# Altium schematic sheet power_amplifier.SchDoc
size A4
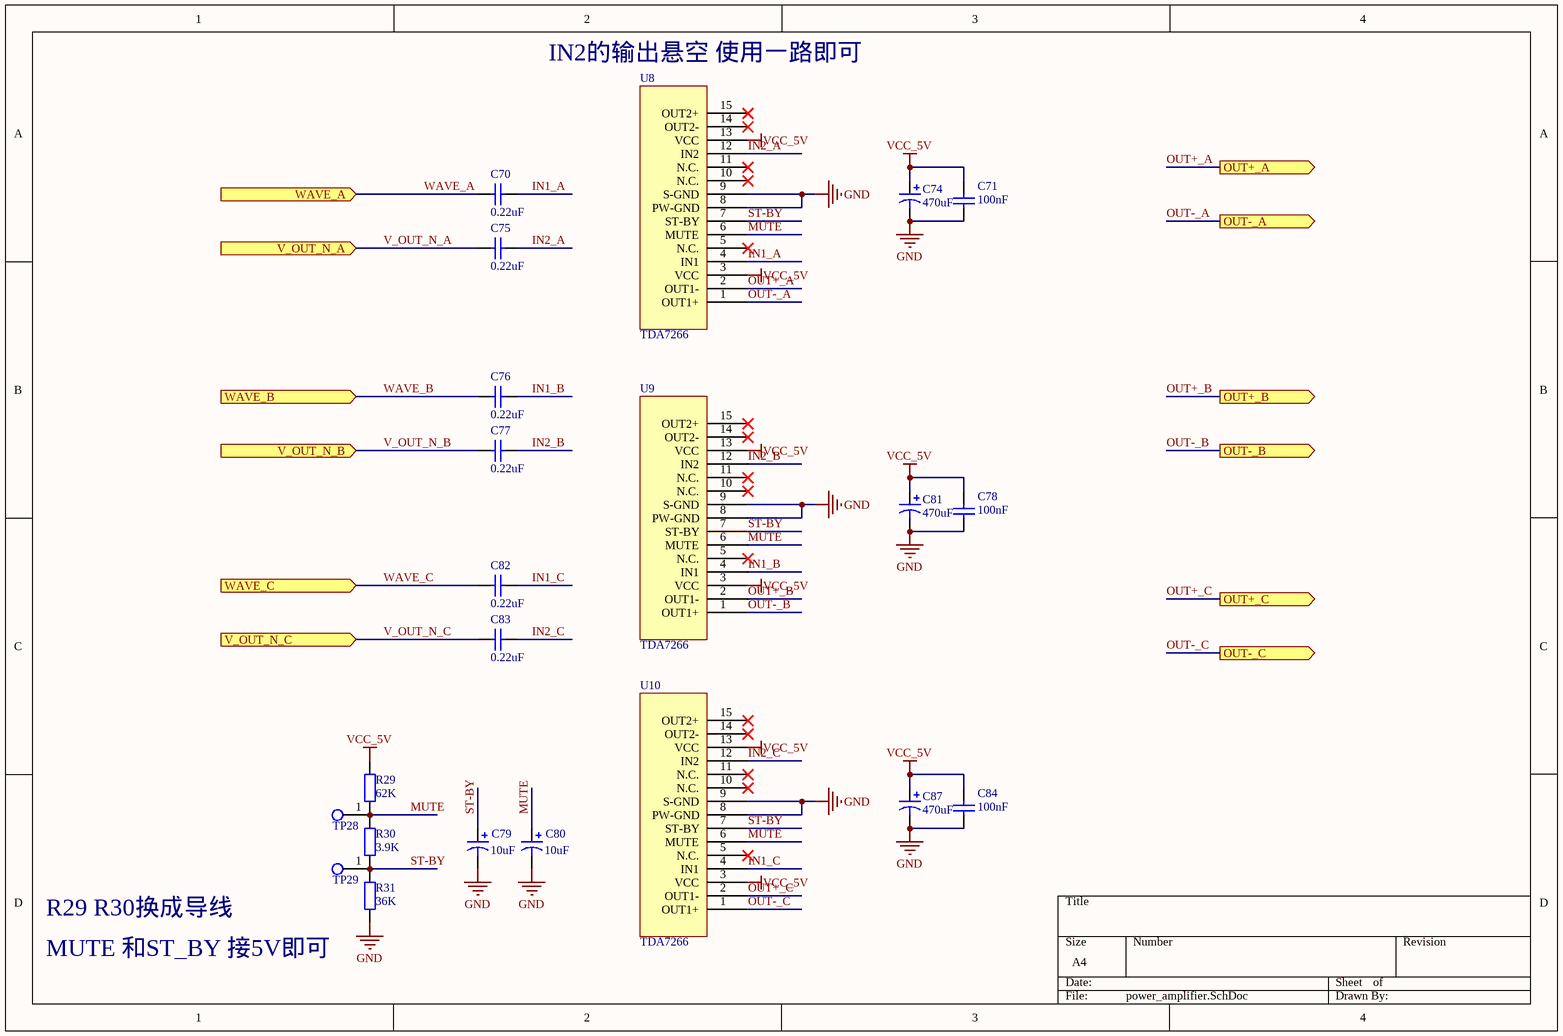
[diagram p0: power_amplifier.SchDoc]

## Parts
C70  value 0.22uF  [0603]  (hidden comment: Cap)
C71  value 100nF  [0603]  (hidden comment: Cap)
C74  value 470uF  [cap贴片铝电解质470uF 16V]  (hidden comment: Cap Poll)
C75  value 0.22uF  [0603]  (hidden comment: Cap)
C76  value 0.22uF  [0603]  (hidden comment: Cap)
C77  value 0.22uF  [0603]  (hidden comment: Cap)
C78  value 100nF  [0603]  (hidden comment: Cap)
C79  value 10uF  [Cap 3528B]  (hidden comment: Cap Poll)
C80  value 10uF  [Cap 3528B]  (hidden comment: Cap Poll)
C81  value 470uF  [cap贴片铝电解质470uF 16V]  (hidden comment: Cap Poll)
C82  value 0.22uF  [0603]  (hidden comment: Cap)
C83  value 0.22uF  [0603]  (hidden comment: Cap)
C84  value 100nF  [0603]  (hidden comment: Cap)
C87  value 470uF  [cap贴片铝电解质470uF 16V]  (hidden comment: Cap Poll)
R29  value 62K  [0603]  (hidden comment: Res)
R30  value 3.9K  [0603]  (hidden comment: Res)
R31  value 36K  [0603]  (hidden comment: Res)
TP28  testPoint  [TP_H]  (value not drawn)
TP29  testPoint  [TP_H]  (value not drawn)
U8  TDA7266  [TDA7266]
U9  TDA7266  [TDA7266]
U10  TDA7266  [TDA7266]

## Ports
OUT+_A (out), OUT+_B (out), OUT+_C (out), OUT-_A (out), OUT-_B (out), OUT-_C (out), V_OUT_N_A (in), V_OUT_N_B (in), V_OUT_N_C (in), WAVE_A (in), WAVE_B (in), WAVE_C (in)

## Nets
GND: C71.1 C74.2 C78.1 C79.2 C80.2 C81.2 C84.1 C87.2 R31.1 U8.8(PW-GND) U8.9(S-GND) U9.8(PW-GND) U9.9(S-GND) U10.8(PW-GND) U10.9(S-GND)
VCC_5V: C71.2 C74.1 C78.2 C81.1 C84.2 C87.1 R29.1 U8.3(VCC) U8.13(VCC) U9.3(VCC) U9.13(VCC) U10.3(VCC) U10.13(VCC)
IN1_A: C70.2 U8.4(IN1)
IN1_B: C76.2 U9.4(IN1)
IN1_C: C82.2 U10.4(IN1)
IN2_A: C75.2 U8.12(IN2)
IN2_B: C77.2 U9.12(IN2)
IN2_C: C83.2 U10.12(IN2)
MUTE: C80.1 R29.2 R30.1 TP28.1 U8.6(MUTE) U9.6(MUTE) U10.6(MUTE)
OUT+_A: U8.2(OUT1-) ; port OUT+_A
OUT+_B: U9.2(OUT1-) ; port OUT+_B
OUT+_C: U10.2(OUT1-) ; port OUT+_C
OUT-_A: U8.1(OUT1+) ; port OUT-_A
OUT-_B: U9.1(OUT1+) ; port OUT-_B
OUT-_C: U10.1(OUT1+) ; port OUT-_C
ST-BY: C79.1 R30.2 R31.2 TP29.1 U8.7(ST-BY) U9.7(ST-BY) U10.7(ST-BY)
V_OUT_N_A: C75.1 ; port V_OUT_N_A
V_OUT_N_B: C77.1 ; port V_OUT_N_B
V_OUT_N_C: C83.1 ; port V_OUT_N_C
WAVE_A: C70.1 ; port WAVE_A
WAVE_B: C76.1 ; port WAVE_B
WAVE_C: C82.1 ; port WAVE_C

Not connected (* = marked no-connect by the designer): U8 5(N.C.)* 10(N.C.)* 11(N.C.)* 14(OUT2-)* 15(OUT2+)*; U9 5(N.C.)* 10(N.C.)* 11(N.C.)* 14(OUT2-)* 15(OUT2+)*; U10 5(N.C.)* 10(N.C.)* 11(N.C.)* 14(OUT2-)* 15(OUT2+)*

## Notes on the sheet
- (near U8) IN2的输出悬空 使用一路即可
- R29 R30换成导线
- MUTE 和ST_BY 接5V即可

## Library data of the parts
C70 C71 C75-C78 C82-C84 = Cap: 原理图绘制者: 刘永钦; 原理图何处使用过: 2014年飞思卡尔底板; 原理图审核人1: 徐鹏飞; 封装0805何处使用: 2015年航行器遥控器; 原理图审核人2: 朱觉文; 封装0603何处使用过: 在2401转接板上使用; Pressure Voltage: 16V; 原理图提供者: 刘永钦; 封装0805绘制者: 刘永钦; 封装0805提供者: 刘永钦; 封装0805审核人1: 徐鹏飞; 封装0805审核人2: 朱觉文; 封装0603绘制者: 刘永钦; 封装0603提供者: 刘永钦; 封装0603审核人1: 朱觉文; 封装0603审核人2: 徐鹏飞
C74 C79-C81 C87 = Cap Poll: 原理图绘制者: 刘永钦; 原理图何处使用过: 2014年飞思卡尔底板; 原理图审核人1: 徐鹏飞; 封装CAP 钽 7343 E何处使用: 2014年飞思卡尔驱动板; 封装cap贴片铝电解质470uF 16V绘制者: 李泽; 封装cap贴片铝电解质470uF 16V何处使用: 2015年飞思卡尔主板; 封装Cap 3528B绘制者: 陈汉诚; 封装Cap 3528B使用过: 2015年飞思卡尔驱动板; 封装Cap直插 10uF 50V: 10级718学长; 封装Cap直插 10uF 50V使用过: 2012年XS128学习板的主板; 封装Cap 3528B审核人2: 朱觉文; 原理图提供者: 刘永钦; 封装CAP 钽 7343 E绘制者: 刘永钦; 封装CAP 钽 7343 E提供者: 刘永钦; 封装CAP 钽 7343 E审核人1: 徐鹏飞; 封装cap贴片铝电解质470uF 16V提供者: 刘永钦; 封装cap贴片铝电解质470uF 16V审核人1: 徐鹏飞; 封装Cap 3528B提供者: 刘永钦; 封装Cap 3528B审核人1: 徐鹏飞; 封装Cap直插 10uF 50V提供者: 刘永钦; 封装Cap直插 10uF 50V审核人1: 徐鹏飞; 封装Cap直插 10uF 50V审核人2: 朱觉文; 封装cap贴片铝电解质470uF 16V审核人2: 朱觉文; 封装CAP 钽 7343 E审核人2: 朱觉文; 原理图审核人2: 朱觉文
R29-R31 = Res: 原理图绘制者: 刘永钦; 原理图何处使用过: 2014年飞思卡尔底板; 原理图审核人1: 徐鹏飞; 封装0805何处使用过: 2015年航行器遥控器; 原理图审核人2: 朱觉文; 封装2512-RESC6332X06N何处使用过: 在无刷直流电机驱动板上使用过; 封装0603何处使用过: 在2401转接板上使用; 原理图提供者: 刘永钦; 封装0805绘制者: 刘永钦; 封装0805提供者: 刘永钦; 封装0805审核人1: 徐鹏飞; 封装0805审核人2: 朱觉文; 封装0603提供者: 刘永钦; 封装0603审核人2: 朱觉文; 封装0603审核人1: 徐鹏飞; 封装2512-RESC6332X06N审核人2: 朱觉文; 封装2512-RESC6332X06N提供者: 刘永钦; 封装2512-RESC6332X06N审核人1: 徐鹏飞; 封装0603绘制者: 刘永钦; 封装2512-RESC6332X06N绘制者: 刘永钦
TP28 TP29 = TP